# EAGLE design untitled (EAGLE 5.12)
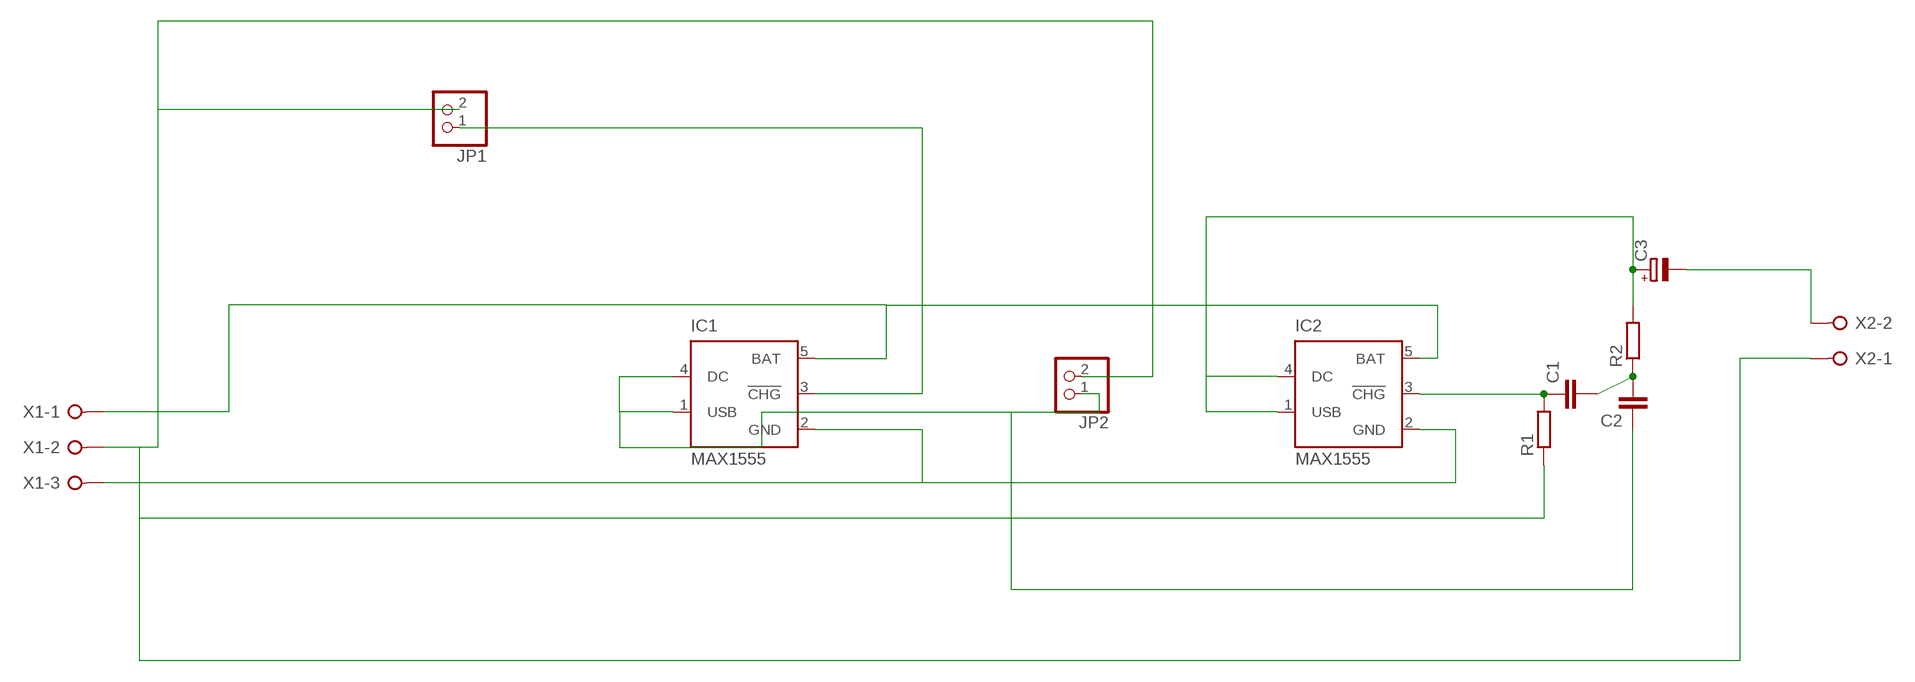
[diagram p0: schematic, sheet 1]

## Parts
C1  C-EU050-025X075  [C050-025X075]
C2  C-EU050-025X075  [C050-025X075]
C3  CPOL-EUE2,5-6E  [E2,5-6E]
IC1  MAX1555  [SOT23-5L]
IC2  MAX1555  [SOT23-5L]
JP1  PINHD-1X2  [1X02]
JP2  PINHD-1X2  [1X02]
R1  R-EU_0204/5  [0204/5]
R2  R-EU_0204/5  [0204/5]
X1  W237-3E  [W237-3E]
X2  W237-02P  [W237-132]

## Nets
N$1: C2.1 IC1.1(USB) IC1.4(DC) JP2.1
N$2: IC1.5(BAT) IC2.5(BAT) X1.1
N$3: JP1.2 JP2.2 R1.1 X1.2 X2.1
N$4: IC1.3(!CHG) JP1.1
N$5: IC1.2(GND) IC2.2(GND) X1.3
N$6: C3.+ IC2.1(USB) IC2.4(DC) R2.2
N$7: C3.- X2.2
N$8: C1.1 IC2.3(!CHG) R1.2
N$10: C1.2 C2.2 R2.1

## Library data of the parts
C1 C2 = resistor:C-EU: CAPACITOR, European symbol
C3 = resistor:CPOL-EU: POLARIZED CAPACITOR, European symbol
IC1 IC2 = maxim:MAX1555: Dual-Input USB/AC Adapter 1-Cell Li+ Battery Chargers Source: http://www.maxim-ic.com .. MAX1551-MAX1555.pdf; MF: MAXIM; MPN: MAX1555EZK+T; OC_FARNELL: 1628222; OC_NEWARK: 59J2761
JP1 JP2 = pinhead:PINHD-1X2: PIN HEADER
R1 R2 = resistor:R-EU_: RESISTOR, European symbol
X1 = con-wago-508:W237-3E: WAGO SREW CLAMP; OC_FARNELL: unknown; OC_NEWARK: unknown
X2 = con-wago-508:W237-02P: WAGO SREW CLAMP; OC_FARNELL: unknown; OC_NEWARK: unknown

## Board
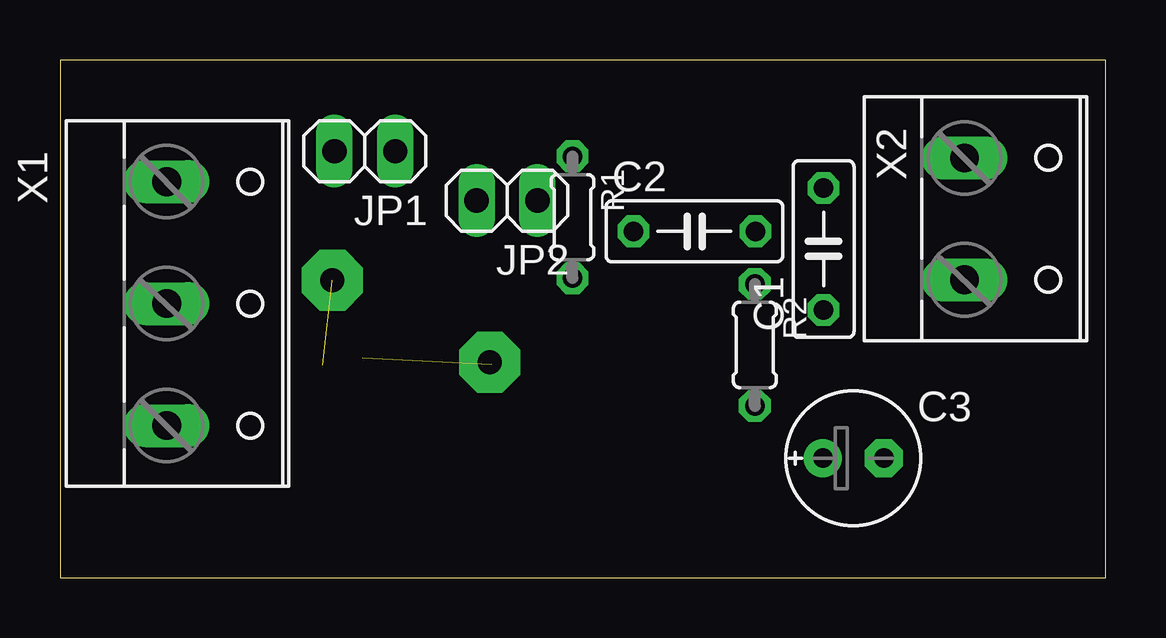
[diagram p1: board, top side]
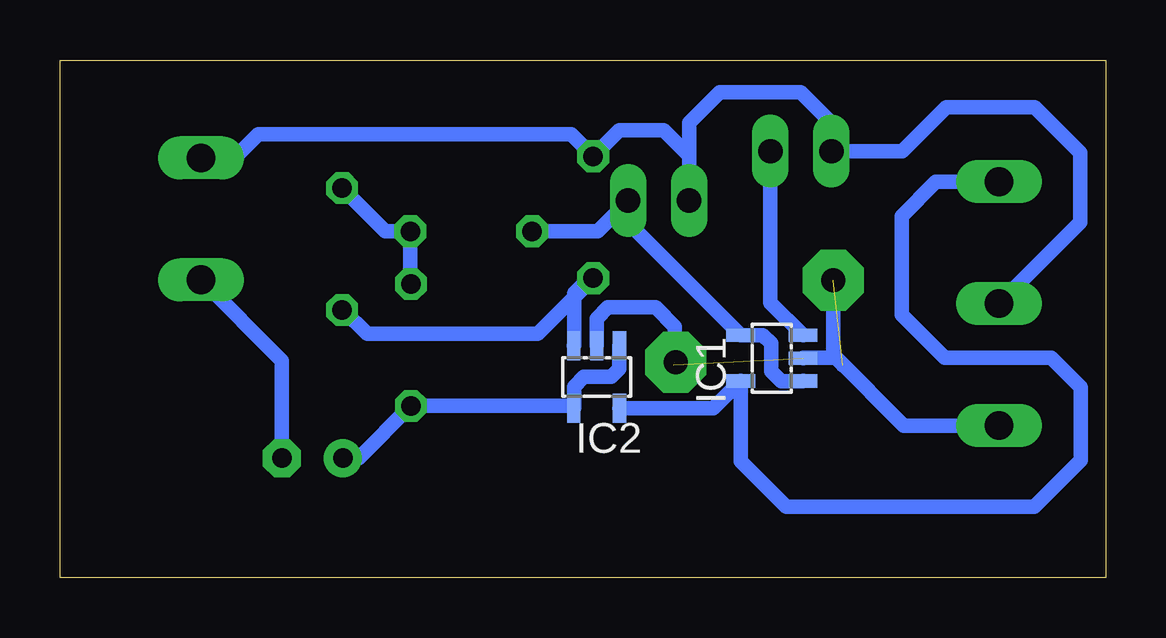
[diagram p2: board, bottom side, seen from below]

Size 43.57 x 21.58 mm. Coordinates in mm from the lower left corner, seen from the top.
Outline: 0,0 43.57,0 43.57,21.58 0,21.58 0,0
Copper layers (1*16): Top 0.035mm / dielectric 1.5mm / Bottom 0.035mm
Design rules "default": minimum track width 10mil, minimum drill 24mil, track to track 8mil, track to pad 8mil, pad to pad 8mil, via to via 8mil, smd to smd 8mil, copper to edge 40mil, drill to drill 8mil, minimum pad ring 10mil, minimum via ring 8mil, stop-mask expansion 4mil, vias tented up to drill 0mil, thermal gap 10mil

### Footprints (pad centres in the part's own frame; a part is rotated, then mirrored left to right if it is on the bottom)
C050-025X075 = drill 0.813 octagon: 1 -2.54,0; 2 2.54,0
E2,5-6E = drill 0.813 pad 1.575 round: + -1.27,0 | drill 0.813 pad 1.575 octagon: - 1.27,0
SOT23-5L = smd 0.55 x 1.2: 1 -0.95,-1.3; 2 0,-1.3; 3 0.95,-1.3; 4 0.95,1.3; 5 -0.95,1.3
1X02 = drill 1.016 long: 1 -1.27,0; 2 1.27,0
0204/5 = drill 0.813 octagon: 1 -2.54,0; 2 2.54,0
W237-3E = drill 1.194 long: 1 -5.08,-0.635; 2 0,-0.635; 3 5.08,-0.635
W237-132 = drill 1.194 long: 1 -2.54,-0.635; 2 2.54,-0.635

### Placement (x,y rotation side)
C1  31.81,13.7 90 top
C2  26.43,14.44 0 top
C3  33.06,4.99 0 top
IC1  13.91,9.16 90 bottom
IC2  21.21,8.37 180 bottom
JP1  12.7,17.78 180 top
JP2  18.63,15.72 180 top
R1  21.35,15.03 270 top
R2  28.95,9.71 270 top
X1  5.08,11.43 270 top
X2  38.33,14.96 270 top

### Tracks (layer width: path | path; a pad name or v marks a point on that pad's centre or on a via)
N$1
  Bottom 0.61: IC1.1 12.63,8.19 13.52,8.19 13.94,8.61 13.94,9.77 14.28,10.11 IC1.4 19.89,14.79 JP2.1 21.17,14.44 C2.1
N$2
  Bottom 0.61: IC2.5 16.34,7.07 IC1.5 15.21,4.87 13.31,2.97 2.97,2.97 1.03,4.9 1.03,7.94 2.27,9.17 6.7,9.17 8.5,10.98 8.5,15.08 7.07,16.51 X1.1
N$3
  Bottom 0.406: X1.2 4.05,11.43
  Bottom 0.61: X2.1 36.29,17.5 35.31,18.48 22.27,18.48 R1.1 20.28,18.65 18.41,18.65 17.36,17.59 JP2.2 17.36,18.96 16.07,20.24 12.71,20.24 11.41,18.95 11.41,17.8 JP1.2 8.48,17.78 6.65,19.62 2.96,19.62 1.06,17.72 1.06,14.81 X1.2
N$4
  Bottom 0.61: JP1.1 13.97,11.47 IC1.3
N$5  (1 unrouted)
  Bottom 0.61: X1.3 8.42,6.35 11.23,9.16 IC1.2 | IC2.2 21.21,10.8 20.74,11.27 18.76,11.27 17.95,10.46 17.95,8.92 17.99,8.88
N$6
  Bottom 0.61: IC2.1 20.26,8.71 20.59,8.38 21.74,8.38 22.14,7.97 22.14,7.09 IC2.4 22.26,7.17 R2.2 31.13,4.99 C3.+
N$7
  Bottom 0.61: C3.- 34.33,9.05 X2.2
N$8
  Bottom 0.61: IC2.3 22.14,9.69 22.14,11.86 21.51,12.49 R1.2 23.66,10.18 30.77,10.18 31.76,11.16 C1.1
N$9  (via drill 1 pad 2.54)
  other vias: 17.91,8.99
N$10
  Bottom 0.406: R2.1 28.97,12.27
  Bottom 0.61: 28.97,12.27 C2.2 30.01,14.44 C1.2
N$11  (via drill 1 pad 2.54)  (1 unrouted)
  Bottom 0.61: v11.35,12.4 11.35,9.29 10.93,8.87 10.95,8.86